# Altium project radio_frequency.PrjPcb
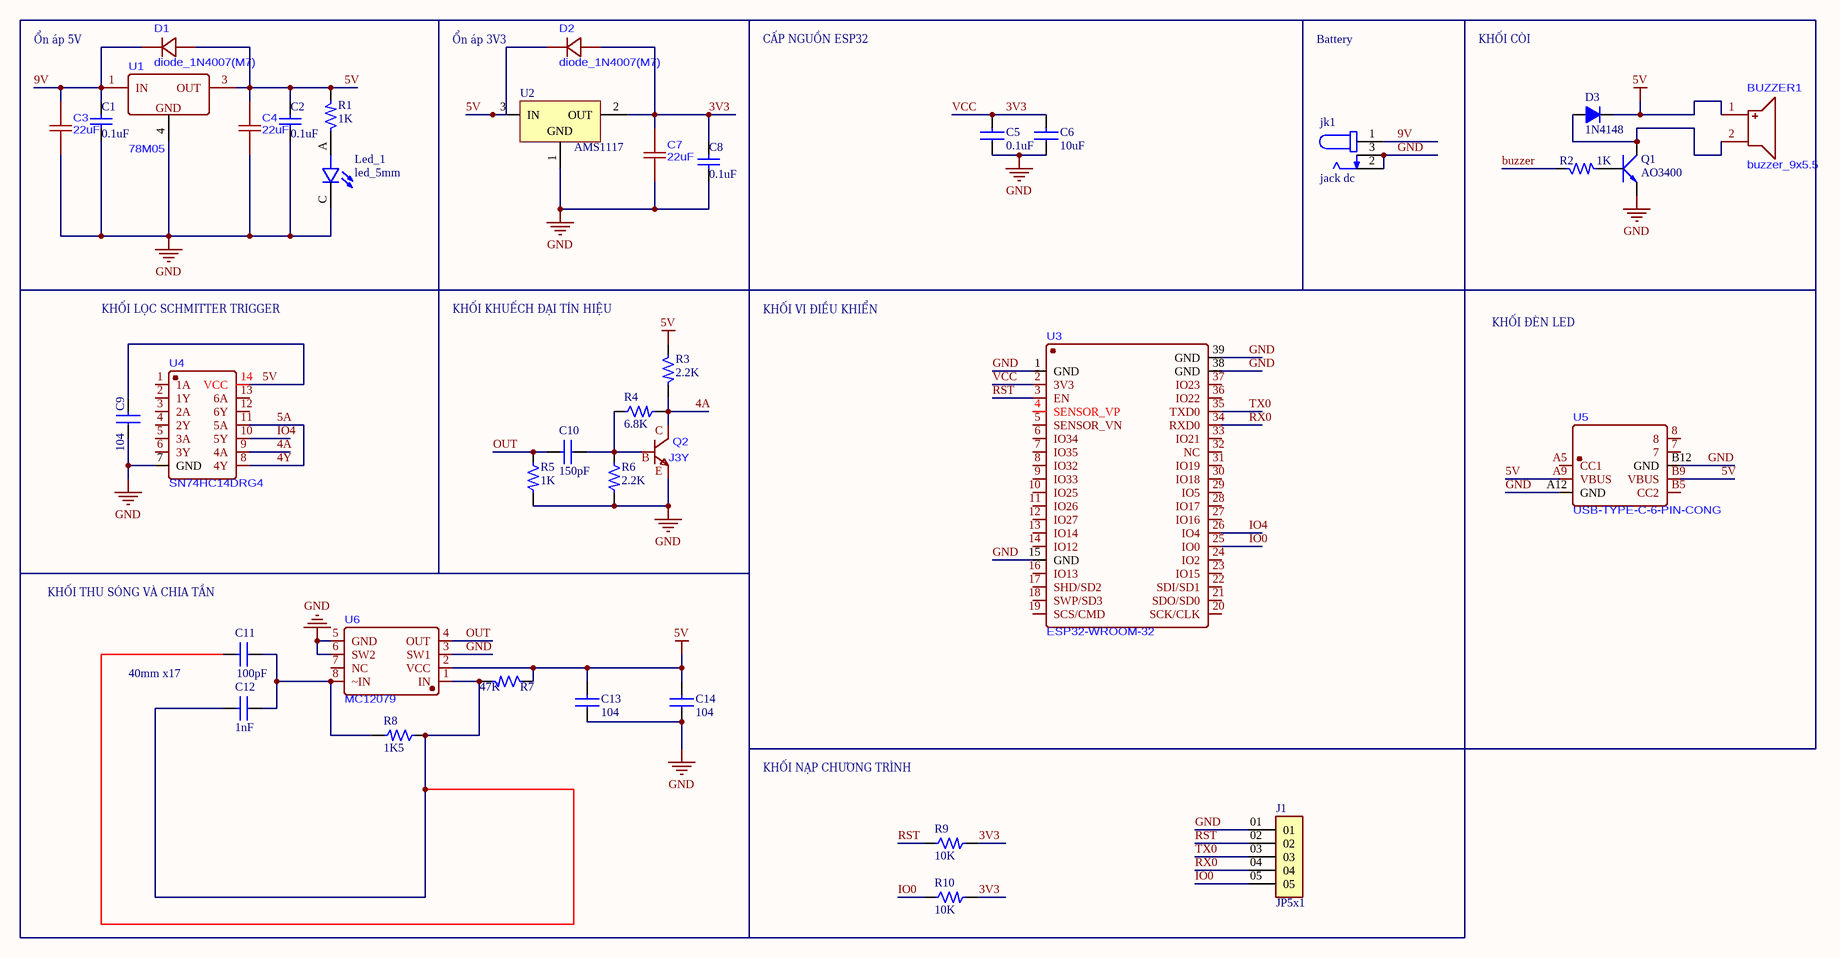
[diagram p0: ver_4.SchDoc]
1 sheet, 39 parts. Net scope: global (net labels, ports and power ports of the same name join across sheets).
Board file: ver7.PcbDoc

## Sheet ver_4.SchDoc
size A2; SheetNumber: 1; SheetTotal: 1

### Parts
BUZZER1  buzzer_9x5.5  [buzzer_9x5.5]
C1  0.1uF  [CN-SMD-0603]
C2  0.1uF  [CN-SMD-0603]
C3  22uF  [cap_1206]
C4  22uF  [cap_1206]
C5  0.1uF  [CN-SMD-0603]
C6  10uF  [CN-SMD-0603]
C7  22uF  [cap_1206]
C8  0.1uF  [CN-SMD-0603]
C9  104  [CN-SMD-0603]
C10  150pF  [CN-SMD-0603]
C11  100pF  [CN-SMD-0603]
C12  1nF  [CN-SMD-0603]
C13  104  [CN-SMD-0603]
C14  104  [CN-SMD-0603]
D1  diode_1N4007(M7)  [diode_1N4007-M7]
D2  diode_1N4007(M7)  [diode_1N4007-M7]
D3  1N4148  [SOD-123]
J1  JP5x1  [JP5x1]
jk1  jack dc  [jack dc]
Led_1  led_5mm  [led_5mm]
Q1  AO3400  [SOT23B]
Q2  J3Y  [j3y]
R1  1K  [RES-SMD-0603]
R2  1K  [RES-SMD-0603]
R3  2.2K  [RES-SMD-0603]
R4  6.8K  [RES-SMD-0603]
R5  1K  [RES-SMD-0603]
R6  2.2K  [RES-SMD-0603]
R7  47K  [RES-SMD-0603]
R8  1K5  [RES-SMD-0603]
R9  10K  [RES-SMD-0603]
R10  10K  [RES-SMD-0603]
U1  78M05  [78M05]
U2  AMS1117  [AMS1117-SOT223]
U3  ESP32-WROOM-32  [ESP-32-WROOM]
U4  SN74HC14DRG4  [74HC14]
U5  USB-TYPE-C-6-PIN-CONG  [USB-TYPE-C-6-PIN-CONG]
U6  MC12079  [MC12079]

### Nets
5V: BUZZER1.1 C2.2 C4.2 C9.2 C13.2 C14.2 D1.2(A) D2.1(K) D3.2(K) R1.2 R3.1 R7.1 U1.3(OUT) U2.3(IN) U4.14(VCC) U5.A9(VBUS) U5.B9(VBUS) U6.2(VCC)
GND: C1.1 C2.1 C3.1 C4.1 C5.1 C6.1 C7.1 C8.1 C9.1 C13.1 C14.1 J1.01 jk1.2 jk1.3 Led_1.C Q1.1(E) Q2.2(E) R5.2 R6.2 U1.4(GND) U2.1(GND) U3.1(GND) U3.15(GND) U3.38(GND) U3.39(GND) U4.7(GND) U5.A12(GND) U5.B12(GND) U6.3(SW1) U6.5(GND) U6.6(SW2)
3V3: C5.2 C6.2 C7.2 C8.2 D2.2(A) R9.2 R10.2 U2.2(OUT) U3.2(3V3)  [also labelled VCC]
4A: Q2.3(C) R3.2 R4.2 U4.9(4A)
4Y: U4.8(4Y) U4.11(5A)  [also labelled 5A]
9V: C1.2 C3.2 D1.1(K) jk1.1 U1.1(IN)
buzzer: R2.1
IO0: J1.05 R10.1 U3.25(IO0)
IO4: U3.26(IO4) U4.10(5Y)
OUT: C10.2 R5.1 U6.4(OUT)
RST: J1.02 R9.1 U3.3(EN)
RX0: J1.04 U3.34(RXD0)
TX0: J1.03 U3.35(TXD0)
NetBUZZER1_2: BUZZER1.2 D3.1(A) Q1.2(C)
NetC10_1: C10.1 Q2.1(B) R4.1 R6.1
NetC11_1: C11.1 C12.1 R8.2 U6.8(~IN)
NetC11_2: C11.2 C12.2 R7.2 R8.1 U6.1(IN)
NetLed_1_A: Led_1.A R1.1
NetQ1_3: Q1.3(B) R2.2

Not connected (* = marked no-connect by the designer): U3 4(SENSOR_VP) 5(SENSOR_VN) 6(IO34) 7(IO35) 8(IO32) 9(IO33) 10(IO25) 11(IO26) 12(IO27) 13(IO14) 14(IO12) 16(IO13) 17(SHD/SD2) 18(SWP/SD3) 19(SCS/CMD) 20(SCK/CLK) 21(SDO/SD0) 22(SDI/SD1) 23(IO15) 24(IO2) 27(IO16) 28(IO17) 29(IO5) 30(IO18) 31(IO19) 32(NC) 33(IO21) 36(IO22) 37(IO23); U4 1(1A) 2(1Y) 3(2A) 4(2Y) 5(3A) 6(3Y) 12(6Y) 13(6A); U5 7 8 A5(CC1) B5(CC2); U6 7(NC)

### Notes on the sheet
- Ổn áp 5V
- Ổn áp 3V3
- CẤP NGUỒN ESP32
- Battery
- KHỐI CÒI
- KHỐI LỌC SCHMITTER TRIGGER
- KHỐI KHUẾCH ĐẠI TÍN HIỆU
- KHỐI VI ĐIỀU KHIỂN
- KHỐI ĐÈN LED
- (near Q2) C
- (near Q2) B
- (near Q2) E
- KHỐI THU SÓNG VÀ CHIA TẦN
- 40mm x17
- KHỐI NẠP CHƯƠNG TRÌNH

### Library data of the parts
C1 C2 C8 = CAP 104
C3 C4 C7 = cap_1206
C5 C6 C9-C14 = Tu 0805_1: Tu 0805; Right: 20; Bottom: 10
D3 = D1A: Diode 1A; Value: 1N4007
Q1 = C1815: NPN 600mW, ECB; Value: C1815
Q2 = S8050/J3Y/0.4
R1 R2 = Res: Resistor 1/4W; Value: R1/4W - 1K
R3-R10 = Tro 0805_1: Tro 0805; Value: R1/4W - 1K